# EAGLE design rhiozme 2.0 smd photon (EAGLE 7.3.0)
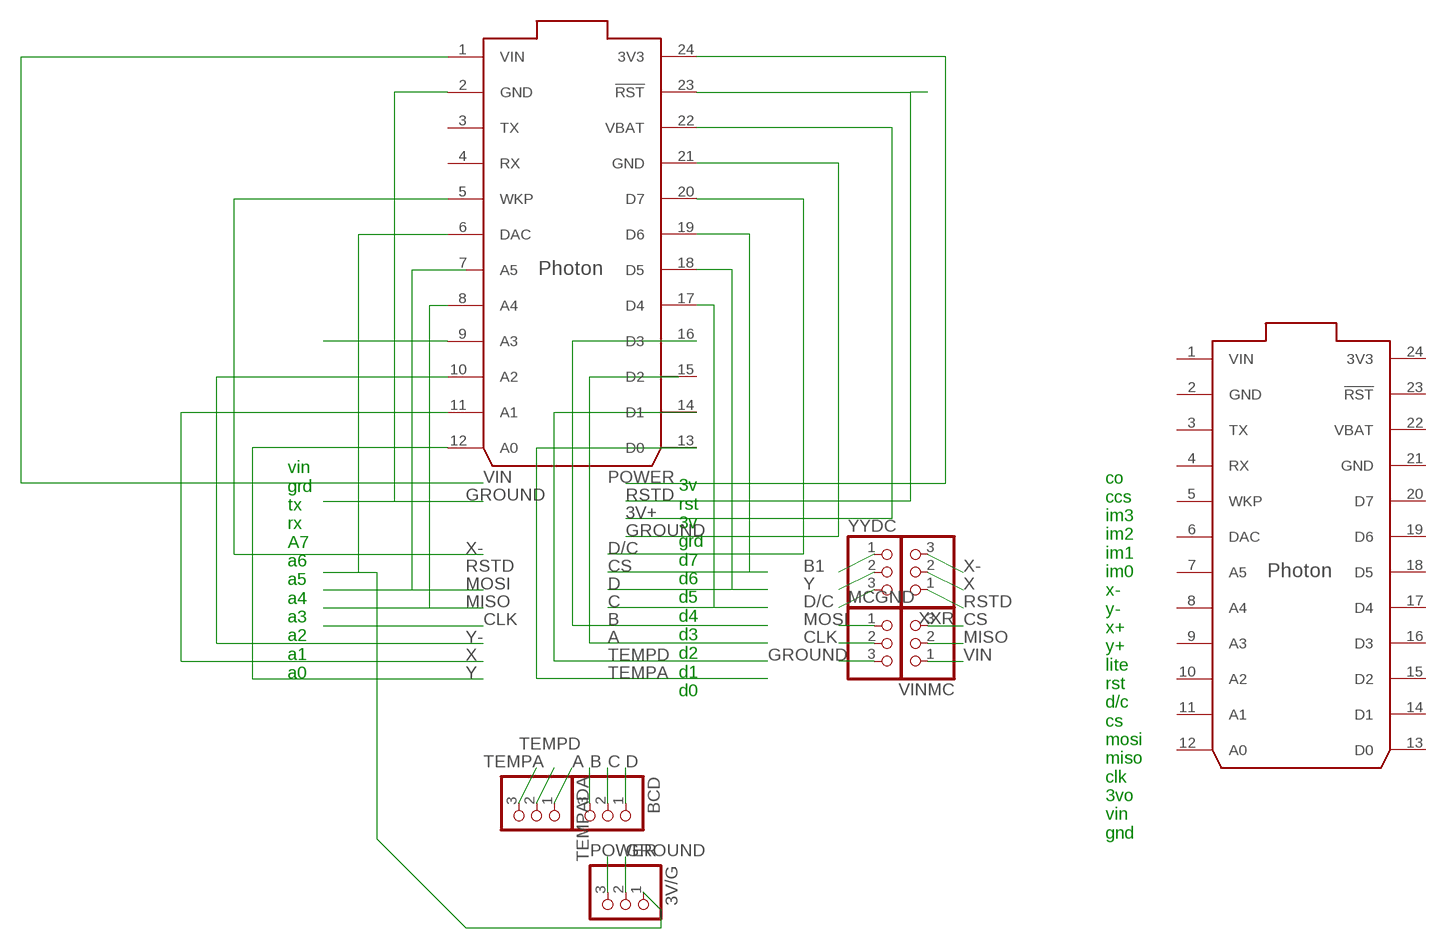
[diagram p0: schematic, sheet 1]

## Parts
3V/G  PINHD-1X3CB  [1X03-CLEANBIG]
BCD  PINHD-1X3CB  [1X03-CLEANBIG]
MCGND  PINHD-1X3CB  [1X03-CLEANBIG]
TEMPADA  PINHD-1X3CB  [1X03-CLEANBIG]
U$2  PHOTON_SMD  [PHOTON_SMD]
U$3  PHOTON_WITH_HEADERS  [PHOTON]
VINMC  PINHD-1X3CB  [1X03-CLEANBIG]
XXR  PINHD-1X3CB  [1X03-CLEANBIG]
YYDC  PINHD-1X3CB  [1X03-CLEANBIG]

## Nets
3V+: U$2.22(VBAT)
A: TEMPADA.1
B: BCD.3 U$2.16(D3)
B1: YYDC.1
C: BCD.2 U$2.17(D4)
CLK: MCGND.2
CS: U$2.19(D6) VINMC.3
D: BCD.1 U$2.18(D5)
D/C: U$2.20(D7) YYDC.3
GROUND: 3V/G.2 MCGND.3 U$2.2(GND) U$2.21(GND)
MISO: U$2.8(A4) VINMC.2
MOSI: MCGND.1
N$5: 3V/G.1 U$2.6(DAC)
N$7: U$2.9(A3)
POWER: 3V/G.3 U$2.24(3V3)
RSTD: U$2.23(!RST) XXR.1
TEMPA: TEMPADA.3 U$2.13(D0)
TEMPD: TEMPADA.2 U$2.14(D1)
VIN: U$2.1(VIN) VINMC.1
X: U$2.11(A1) XXR.2
X-: U$2.5(WKP) XXR.3
Y: U$2.12(A0) YYDC.2
Y-: U$2.10(A2)
Unconnected: U$2.3(TX) U$2.4(RX) U$2.7(A5) U$2.15(D2) U$2.25(EN) U$2.26(!SETUP) U$2.27(RGB_RED) U$2.28(RGB_GREEN) U$2.29(RGB_BLUE) U$2.30(USB_D-) U$2.31(USB_D+) U$3.3(TX) U$3.4(RX) U$3.5(WKP) U$3.6(DAC) U$3.7(A5) U$3.8(A4) U$3.9(A3) U$3.10(A2) U$3.11(A1) U$3.12(A0) U$3.13(D0) U$3.14(D1) U$3.15(D2) U$3.16(D3) U$3.17(D4) U$3.18(D5) U$3.19(D6) U$3.20(D7) U$3.23(!RST)

## Notes on the sheet
- vin
  grd
  tx
  rx
  A7
  a6
  a5
  a4
  a3
  a2
  a1
  a0
- 3v
  rst
  3v
  grd
  d7
  d6
  d5
  d4
  d3
  d2
  d1
  d0
- co
  ccs
  im3
  im2
  im1
  im0
  x-
  y-
  x+
  y+
  lite
  rst
  d/c
  cs
  mosi
  miso
  clk
  3vo
  vin
  gnd

## Power pins joined to a net without a drawn wire
3V3: U$3.24(3V3)
GND: U$3.2(GND) U$3.21(GND)
VBAT: U$3.22(VBAT)
VIN: U$3.1(VIN)

## Library data of the parts
3V/G BCD MCGND TEMPADA VINMC XXR YYDC = adafruit:PINHD-1X3: PIN HEADER
U$2 = Spark:PHOTON_SMD: Photon (without headers) - designed to be surface mounted with 7 extra exposed pads on the bottom of the board which include, 3 RGB LED outputs, /SETUP, EN (3.3V SMPS enable input), USB D+ and USB D-.
U$3 = Spark:PHOTON

## Board
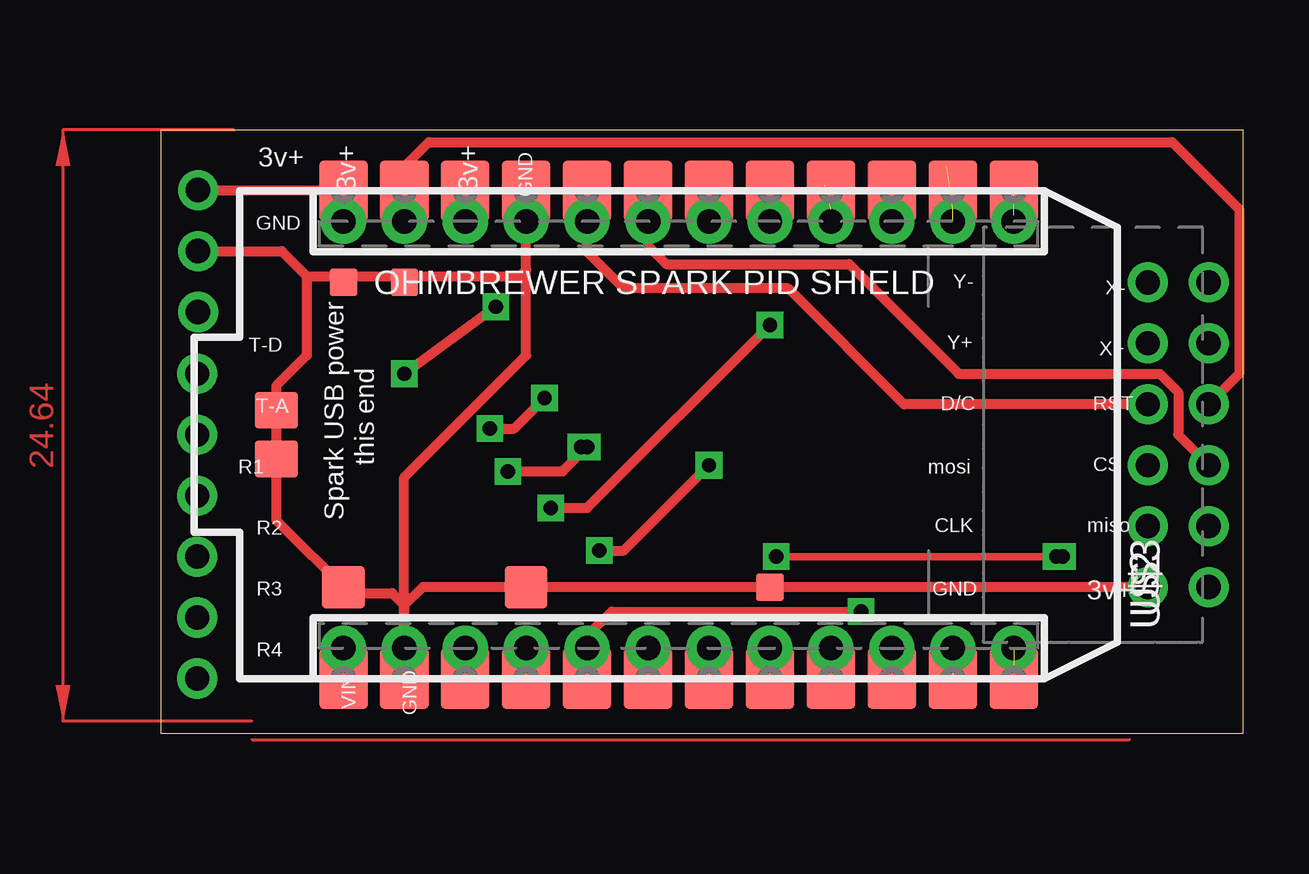
[diagram p1: board, top side]
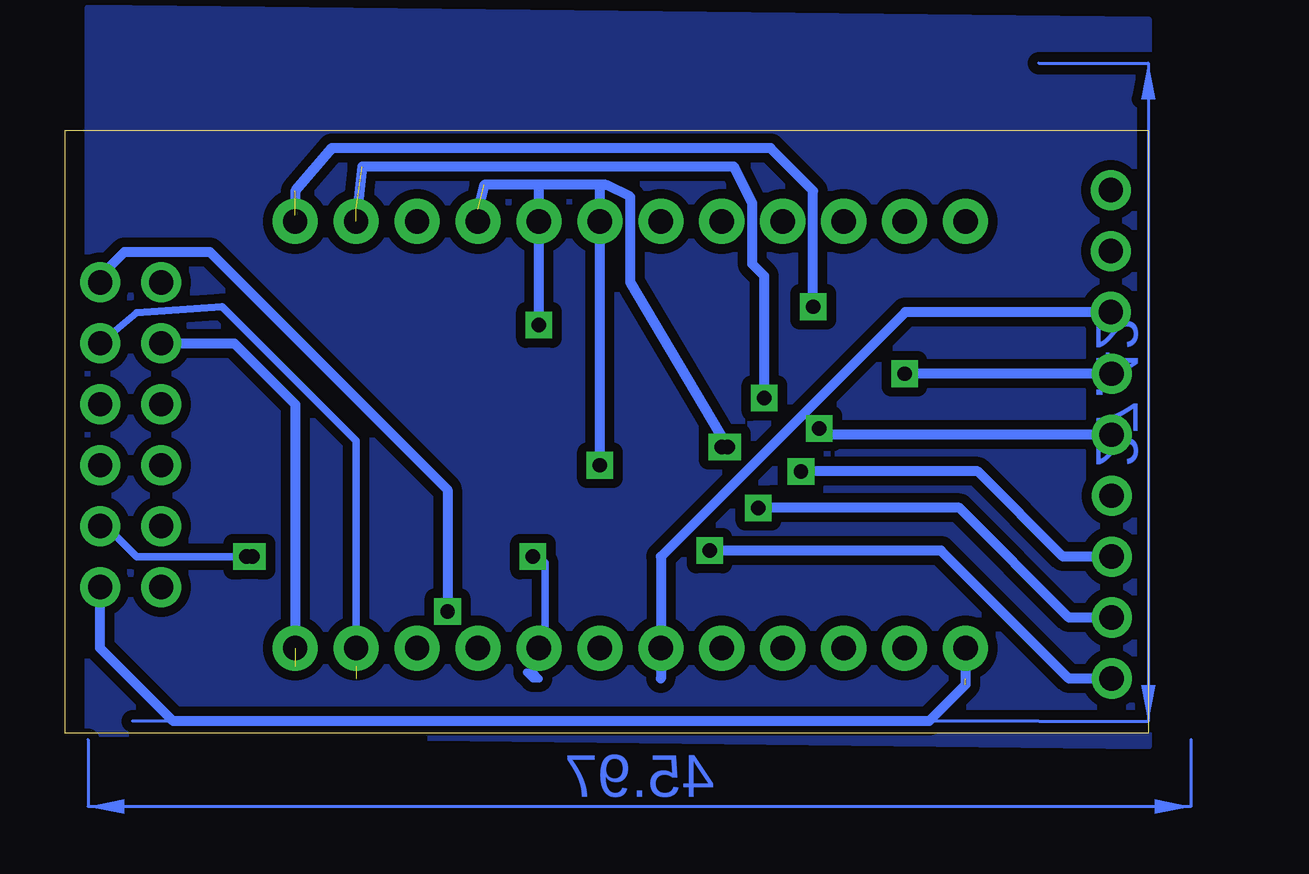
[diagram p2: board, bottom side, seen from below]

Size 45.14 x 25.14 mm. Coordinates in mm from the lower left corner, seen from the top.
Outline: 0,0 45.14,0 45.14,25.14 0,25.14 0,0
Copper layers (1*16): Top 0.035mm / dielectric 1.5mm / Bottom 0.035mm
Design rules "Othermill-DRC-1-64": minimum track width 8mil, minimum drill 0.8mm, track to track 0.39878125mm, track to pad 0.39878125mm, pad to pad 0.39878125mm, via to via 0.39878125mm, smd to smd 0mil, copper to edge 0mil, drill to drill 1mil, minimum pad ring 10mil, minimum via ring 10mil, stop-mask expansion 1mil, vias tented up to drill 30mil, thermal gap 10mil

### Footprints (pad centres in the part's own frame; a part is rotated, then mirrored left to right if it is on the bottom)
1X03-CLEANBIG = drill 1.016 pad 1.676: 1 -2.54,0; 2 0,0; 3 2.54,0
STAND-OFF-TIGHT = hole 3.048: 0,0
PHOTON_SMD = smd 2.54 x 2.032: 1 0,32.258; 2 0,29.718; 3 0,27.178; 4 0,24.638; 5 0,22.098; 6 0,19.558; 7 0,17.018; 8 0,14.478; 9 0,11.938; 10 0,9.398; 11 0,6.858; 12 0,4.318; 13 20.32,4.318; 14 20.32,6.858; 15 20.32,9.398; 16 20.32,11.938; 17 20.32,14.478; 18 20.32,17.018; 19 20.32,19.558; 20 20.32,22.098; 21 20.32,24.638; 22 20.32,27.178; 23 20.32,29.718; 24 20.32,32.258 | smd 1.778 x 1.778: 25 3.81,32.258; 26 3.81,24.638 | smd 1.143 x 1.143: 27 3.81,14.478; 28 16.51,29.718; 29 16.51,32.258 | smd 1.524 x 1.778: 30 11.176,35.052; 31 9.144,35.052
PHOTON = drill 1.016 pad 1.88: 1 1.27,32.258; 2 1.27,29.718; 3 1.27,27.178; 4 1.27,24.638; 5 1.27,22.098; 6 1.27,19.558; 7 1.27,17.018; 8 1.27,14.478; 9 1.27,11.938; 10 1.27,9.398; 11 1.27,6.858; 12 1.27,4.318; 13 19.05,4.318; 14 19.05,6.858; 15 19.05,9.398; 16 19.05,11.938; 17 19.05,14.478; 18 19.05,17.018; 19 19.05,19.558; 20 19.05,22.098; 21 19.05,24.638; 22 19.05,27.178; 23 19.05,29.718; 24 19.05,32.258

### Placement (x,y rotation side)
3V/G  1.56,20.1 90 top
BCD  1.52,4.83 90 top
MCGND  41.15,8.64 270 top
TEMPADA  1.52,12.45 90 top
U$1  [STAND-OFF-TIGHT]  49.54,12.14 0 top  (outside the outline)
U$2  39.88,2.29 90 top
U$3  39.88,2.29 90 top
VINMC  43.69,8.64 90 top
XXR  43.69,16.26 90 top
YYDC  41.15,16.26 270 top

### Tracks (layer width: path | path; a pad name or v marks a point on that pad's centre or on a via)
B  (via drill 0.6)  (1 unrouted)
  Top 0.406: v14.48,10.92 16.76,10.92 17.78,11.94 v17.53,11.94
  Bottom 0.406: BCD.3 3.56,7.37 7.11,10.92 v14.48,10.92 | v17.53,11.94 21.59,18.8 21.59,22.35 22.61,22.86 27.69,22.86 27.94,21.84
C  (via drill 0.6)  (1 unrouted)
  Top 0.406: v16.26,9.4 17.78,9.4 v25.4,17.02
  Bottom 0.406: BCD.2 3.3,4.83 7.87,9.4 v16.26,9.4 | v25.4,17.02 U$2.17
CS
  Top 0.406: U$2.19 20.32,20.32 21.08,19.56 28.7,19.56 33.27,14.99 41.66,14.99 42.42,14.22 42.42,12.45 VINMC.3
D  (via drill 0.6)  (1 unrouted)
  Top 0.406: v18.29,7.62 19.3,7.62 v22.86,11.18
  Bottom 0.406: BCD.1 3.3,2.29 8.64,7.62 v18.29,7.62 | v22.86,11.18 U$2.18
D/C
  Top 0.406: YYDC.3 30.99,13.72 26.16,18.54 19.3,18.54 17.78,20.07 U$2.20
GND
  Top 0.406: U$3.2 10.16,10.67 15.24,15.75 U$3.21
GROUND
  Top 0.406: 3V/G.2 5.05,20.1 6.1,19.05 | 6.1,19.05 14.99,19.05 15.24,19.3 U$2.21 | 6.1,19.05 6.1,15.75 4.83,14.48 4.83,8.89 7.87,5.84 9.65,5.84 10.16,5.33 | 10.16,5.33 U$2.2 | MCGND.3 10.92,6.1 10.16,5.33
MISO  (via drill 0.6)
  Top 0.305: v37.59,7.37 v25.65,7.37
  Bottom 0.305: VINMC.2 43.43,8.64 42.16,7.37 v37.59,7.37 v37.34,7.37 | v25.65,7.37 25.4,7.37 25.15,7.11 25.15,4.06 25.65,3.56 25.65,2.54 | 25.65,2.54 25.91,2.54 25.65,2.29 U$2.8 25.65,2.54
N$1
  pour Bottom: 0,29.72 44.2,30.23 44.2,0 0,-0.51
N$2  (via drill 0.6)
  other vias: 29.21,5.08
N$5  (1 unrouted)
  Bottom 0.406: 3V/G.1 10.13,17.56 20.32,7.37 U$2.6
N$11  (via drill 0.6)
  other vias: 17.78,11.94
POWER
  Top 0.406: 3V/G.3 7.59,22.64 U$2.24
RSTD
  Top 0.406: U$2.23 10.16,23.62 11.18,24.64 42.16,24.64 44.96,21.84 44.96,14.99 XXR.1
TEMPA  (via drill 0.6)  (1 unrouted)
  Top 0.406: v10.16,14.99 v13.97,17.78
  Bottom 0.406: TEMPADA.3 v10.16,14.99 | v13.97,17.78 13.97,22.61 15.75,24.38 34.04,24.38 U$2.13 35.56,21.59
TEMPD  (via drill 0.6)  (3 unrouted)
  Top 0.406: v13.72,12.7 14.73,12.7 v16,13.97
  Bottom 0.406: TEMPADA.2 13.21,12.45 13.46,12.7 v13.72,12.7 | v16,13.97 16,19.05 16.51,19.56 16.51,22.1 17.27,23.62 32.77,23.62 33.02,21.34
VIN  (1 unrouted)
  Bottom 0.406: U$3.1 7.62,2.03 9.14,0.51 40.64,0.51 43.69,3.56 VINMC.1
X  (1 unrouted)
  Bottom 0.305: XXR.2 42.16,17.53 38.61,17.78 33.02,12.19 33.02,2.79
X-  (1 unrouted)
  Top 0.406: U$2.5 17.78,4.06 18.8,5.08 29.21,5.08
  Bottom 0.406: XXR.3 43.69,19.05 42.67,20.07 39.12,20.07 29.21,10.16 29.21,5.33 28.96,5.08
Y  (1 unrouted)
  Top 0.406: U$2.12 35.81,2.54 35.56,2.79
  Bottom 0.406: YYDC.2 38.1,16.26 35.56,13.72 35.56,3.56
(copper drawn outside any net)
  shapes: Bottom area x5, Top area x2

### Text on the board
Name: A6
tSilk: 3v+ | 3v+ | 3v+ | GND | GND | OHMBREWER SPARK PID SHIELD | Y- | X- | T-D | Y+ | X+ | T-A | D/C | RST | R1 | this end | mosi | CS | R2 | Spark USB power | CLK | miso | R3 | GND | 3v+ | R4 | VIN | GND